# Altium schematic sheet DT01_Mounts.SchDoc: DT01 Mounts
size A4; DocumentNumber: 3; SheetNumber: 3; SheetTotal: 12
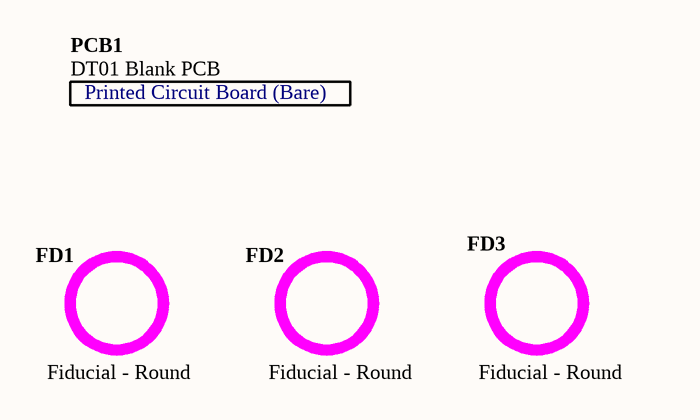
[diagram p0: DT01_Mounts.SchDoc]

## Parts
FD1  Fiducial - Round  [FIDUCIAL 2]
FD2  Fiducial - Round  [FIDUCIAL 2]
FD3  Fiducial - Round  [FIDUCIAL 2]
PCB1  DT01 Blank PCB

## Notes on the sheet
- Sheet Title
- Project Title
- Size:
- Date:
- A4
- Assy:
- Time:
- Revision:
- Sheet
- of
- File:
- (in symbol D-810-0014) Printed Circuit Board (Bare)

## Library data of the parts
FD1-FD3 = D-004-0001: Fiducial - Round 1.5mm Top-Bottom; Status: Unreleased; Category: Fiducial
PCB1 = D-810-0014: DT01 Blank PCB - USB JTAG Adaptor with SD Card and 1-Wire; ProjectPath: DT01.PrjPCB; Status: Unreleased; Category: Blank PCB